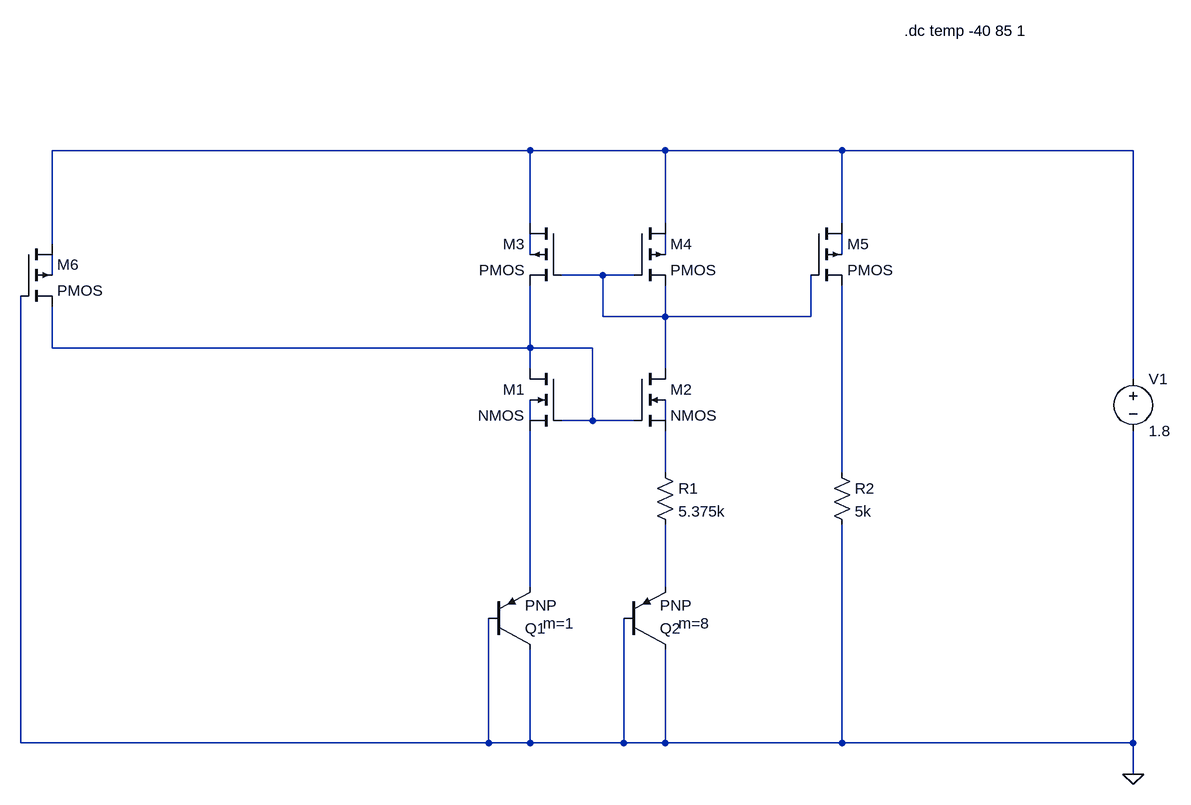
[diagram p0: schematic PTAT.asc]
PTAT.asc, the LTspice schematic file:
Version 4
SHEET 1 1136 772
WIRE 144 -208 -592 -208
WIRE 352 -208 144 -208
WIRE 624 -208 352 -208
WIRE 1072 -208 624 -208
WIRE 144 -96 144 -208
WIRE 352 -96 352 -208
WIRE 624 -96 624 -208
WIRE -592 -64 -592 -208
WIRE 144 -48 144 -80
WIRE 352 -48 352 -80
WIRE 624 -48 624 -80
WIRE -592 -16 -592 -48
WIRE 256 -16 192 -16
WIRE 304 -16 256 -16
WIRE 256 48 256 -16
WIRE 352 48 352 0
WIRE 352 48 256 48
WIRE 576 48 576 -16
WIRE 576 48 352 48
WIRE -592 96 -592 32
WIRE 144 96 144 0
WIRE 144 96 -592 96
WIRE 240 96 144 96
WIRE 144 128 144 96
WIRE 352 128 352 48
WIRE 1072 144 1072 -208
WIRE 144 208 144 176
WIRE 240 208 240 96
WIRE 240 208 192 208
WIRE 304 208 240 208
WIRE 352 208 352 176
WIRE 352 288 352 224
WIRE 624 288 624 0
WIRE 144 464 144 224
WIRE 352 464 352 368
WIRE -640 704 -640 16
WIRE 80 704 80 512
WIRE 80 704 -640 704
WIRE 144 704 144 560
WIRE 144 704 80 704
WIRE 288 704 288 512
WIRE 288 704 144 704
WIRE 352 704 352 560
WIRE 352 704 288 704
WIRE 624 704 624 368
WIRE 624 704 352 704
WIRE 1072 704 1072 224
WIRE 1072 704 624 704
WIRE 1072 752 1072 704
FLAG 1072 752 0
SYMBOL nmos4 192 128 M0
SYMATTR InstName M1
SYMATTR Value2 l=1u w=10u
SYMBOL nmos4 304 128 R0
SYMATTR InstName M2
SYMATTR Value2 l=1u w=10u
SYMBOL pmos4 192 -96 M0
SYMATTR InstName M3
SYMATTR Value2 l=1u w=10u
SYMBOL pmos4 304 -96 R0
SYMATTR InstName M4
SYMATTR Value2 l=1u w=10u
SYMBOL pmos4 576 -96 R0
SYMATTR InstName M5
SYMATTR Value2 l=1u w=10u
SYMBOL res 336 272 R0
SYMATTR InstName R1
SYMATTR Value 5.375k
SYMBOL pnp 80 560 M180
WINDOW 123 84 40 Left 2
SYMATTR InstName Q1
SYMATTR Value2 m=1
SYMBOL pnp 288 560 M180
WINDOW 123 84 40 Left 2
SYMATTR InstName Q2
SYMATTR Value2 m=8
SYMBOL voltage 1072 128 R0
WINDOW 123 0 0 Left 0
WINDOW 39 0 0 Left 0
SYMATTR InstName V1
SYMATTR Value 1.8
SYMBOL pmos4 -640 -64 R0
SYMATTR InstName M6
SYMATTR Value2 l=50u w=1u
SYMBOL res 608 272 R0
SYMATTR InstName R2
SYMATTR Value 5k
TEXT 720 -392 Left 2 !.dc temp -40 85 1

The netlist it stands for:
* PTAT.asc
M1 N007 N007 N012 N008 NMOS l=1u w=10u
M2 N006 N007 N010 N009 NMOS l=1u w=10u
M3 N001 N006 N007 N002 PMOS l=1u w=10u
M4 N001 N006 N006 N003 PMOS l=1u w=10u
M5 N001 N006 N011 N004 PMOS l=1u w=10u
R1 N010 N013 5.375k
Q1 0 0 N012 0 PNP m=1
Q2 0 0 N013 0 PNP m=8
V1 N001 0 1.8
M6 N001 0 N007 N005 PMOS l=50u w=1u
R2 N011 0 5k
.model NPN NPN
.model PNP PNP
.lib standard.bjt
.model NMOS NMOS
.model PMOS PMOS
.lib standard.mos
.dc temp -40 85 1
.backanno
.end